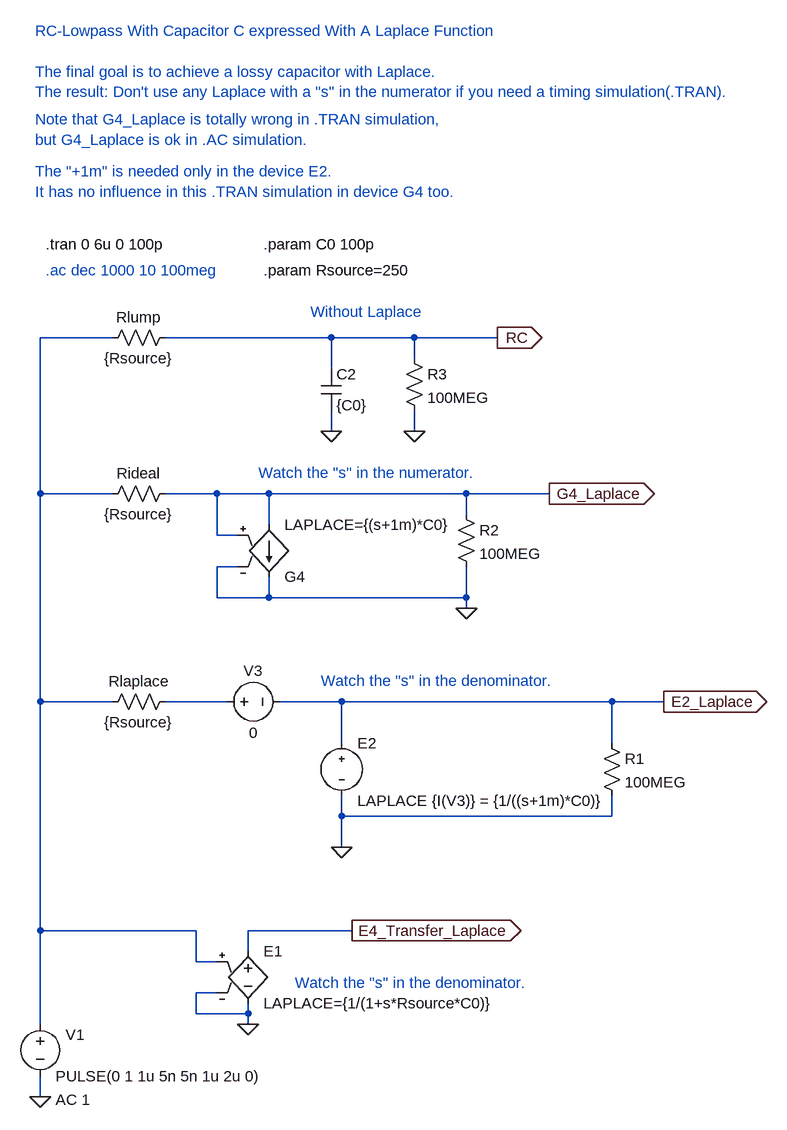
[diagram p0: schematic rc_cap_laplace.asc]
rc_cap_laplace.asc, the LTspice schematic file:
Version 4
SHEET 1 1820 680
WIRE -64 480 -64 512
WIRE 400 48 400 80
WIRE 400 -96 400 -32
WIRE 400 80 400 128
WIRE 304 -96 400 -96
WIRE 816 48 816 80
WIRE 816 80 400 80
WIRE 816 -32 816 -96
WIRE 816 -96 400 -96
WIRE 128 -96 224 -96
WIRE 384 -544 384 -512
WIRE 384 -608 384 -656
WIRE 384 -656 512 -656
WIRE 384 -656 128 -656
WIRE -64 -656 -64 -416
WIRE 48 -656 -64 -656
WIRE 592 -416 592 -384
WIRE 592 -256 288 -256
WIRE 592 -256 592 -240
WIRE 128 -416 208 -416
WIRE -64 -416 -64 -96
WIRE 176 256 176 304
WIRE 176 304 208 304
WIRE 208 352 176 352
WIRE 176 352 176 384
WIRE 176 384 256 384
WIRE 256 384 256 368
WIRE 256 384 256 400
WIRE 256 288 256 256
WIRE 48 -416 -64 -416
WIRE -64 256 -64 400
WIRE 592 -304 592 -256
WIRE 288 -368 288 -416
WIRE 288 -416 592 -416
WIRE 288 -288 288 -256
WIRE 512 -656 512 -624
WIRE 512 -544 512 -512
WIRE 48 -96 -64 -96
WIRE -64 -96 -64 256
WIRE 512 -656 640 -656
WIRE 592 -416 720 -416
WIRE 816 -96 896 -96
WIRE 176 256 -64 256
WIRE 256 256 416 256
WIRE 240 -352 208 -352
WIRE 208 -352 208 -416
WIRE 208 -416 288 -416
WIRE 240 -304 208 -304
WIRE 208 -304 208 -256
WIRE 208 -256 288 -256
FLAG -64 512 0
FLAG 400 128 0
FLAG 384 -512 0
FLAG 592 -240 0
FLAG 256 400 0
FLAG 512 -512 0
FLAG 640 -656 RC
IOPIN 640 -656 Out
FLAG 720 -416 G4_Laplace
IOPIN 720 -416 Out
FLAG 896 -96 E2_Laplace
IOPIN 896 -96 Out
FLAG 416 256 E4_Transfer_Laplace
IOPIN 416 256 Out
SYMBOL res 800 -48 R0
SYMATTR InstName R1
SYMATTR Value 100MEG
SYMBOL voltage -64 384 R0
WINDOW 123 24 132 Left 0
WINDOW 39 0 0 Left 0
WINDOW 0 39 32 Left 0
SYMATTR Value2 AC 1
SYMATTR InstName V1
SYMATTR Value PULSE(0 1 1u 5n 5n 1u 2u 0)
SYMBOL res 32 -80 R270
WINDOW 0 32 56 VTop 0
WINDOW 3 0 56 VBottom 0
SYMATTR InstName Rlaplace
SYMATTR Value {Rsource}
SYMBOL cap 368 -608 R0
SYMATTR InstName C2
SYMATTR Value {C0}
SYMBOL res 32 -640 R270
WINDOW 0 32 56 VTop 0
WINDOW 3 0 56 VBottom 0
SYMATTR InstName Rlump
SYMATTR Value {Rsource}
SYMBOL res 32 -400 R270
WINDOW 0 32 56 VTop 0
WINDOW 3 0 56 VBottom 0
SYMATTR InstName Rideal
SYMATTR Value {Rsource}
SYMBOL e 256 272 R0
SYMATTR InstName E1
SYMATTR Value LAPLACE={1/(1+s*Rsource*C0)}
SYMBOL voltage 208 -96 R270
WINDOW 0 32 56 VTop 0
WINDOW 3 -32 56 VBottom 0
SYMATTR InstName V3
SYMATTR Value 0
SYMBOL Misc\\Epoly 400 -48 R0
SYMATTR InstName E2
SYMATTR Value LAPLACE {I(V3)} = {1/((s+1m)*C0)}
SYMBOL res 576 -400 R0
SYMATTR InstName R2
SYMATTR Value 100MEG
SYMBOL res 496 -640 R0
SYMATTR InstName R3
SYMATTR Value 100MEG
SYMBOL g2 288 -272 M180
SYMATTR InstName G4
SYMATTR Value LAPLACE={(s+1m)*C0}
TEXT 280 -800 Left 0 !.param C0 100p
TEXT -56 -760 Left 0 ;.ac dec 1000 10 100meg
TEXT -56 -800 Left 0 !.tran 0 6u 0 100p
TEXT 280 -760 Left 0 !.param Rsource=250
TEXT -72 -1128 Left 0 ;RC-Lowpass With Capacitor C expressed With A Laplace Function\n \nThe final goal is to achieve a lossy capacitor with Laplace.\nThe result: Don't use any Laplace with a "s" in the numerator if you need a timing simulation(.TRAN).
TEXT -72 -992 Left 0 ;Note that G4_Laplace is totally wrong in .TRAN simulation, \nbut G4_Laplace is ok in .AC simulation.
TEXT -72 -912 Left 0 ;The "+1m" is needed only in the device E2.\nIt has no influence in this .TRAN simulation in device G4 too.
TEXT 272 -448 Left 0 ;Watch the "s" in the numerator.
TEXT 368 -128 Left 0 ;Watch the "s" in the denominator.
TEXT 328 336 Left 0 ;Watch the "s" in the denominator.
TEXT 352 -696 Left 0 ;Without Laplace

The netlist it stands for:
* rc_cap_laplace.asc
R1 E2_Laplace 0 100MEG
V1 N002 0 PULSE(0 1 1u 5n 5n 1u 2u 0) AC 1
Rlaplace N002 N001 {Rsource}
C2 RC 0 {C0}
Rlump N002 RC {Rsource}
Rideal N002 G4_Laplace {Rsource}
E1 E4_Transfer_Laplace 0 N002 0 LAPLACE={1/(1+s*Rsource*C0)}
V3 N001 E2_Laplace 0
E2 E2_Laplace 0 LAPLACE {I(V3)} = {1/((s+1m)*C0)}
R2 G4_Laplace 0 100MEG
R3 RC 0 100MEG
G4 G4_Laplace 0 G4_Laplace 0 LAPLACE={(s+1m)*C0}
.param C0 100p
* .ac dec 1000 10 100meg
.tran 0 6u 0 100p
.param Rsource=250
* RC-Lowpass With Capacitor C expressed With A Laplace Function
* The final goal is to achieve a lossy capacitor with Laplace.
* The result: Don't use any Laplace with a "s" in the numerator if you need a timing simulation(.TRAN).
* Note that G4_Laplace is totally wrong in .TRAN simulation,
* but G4_Laplace is ok in .AC simulation.
* The "+1m" is needed only in the device E2.
* It has no influence in this .TRAN simulation in device G4 too.
* Watch the "s" in the numerator.
* Watch the "s" in the denominator.
* Watch the "s" in the denominator.
* Without Laplace
.backanno
.end